# Altium schematic sheet MAX5875_0.SchDoc
size A; DocumentNumber: 3; SheetNumber: 13; SheetTotal: 24
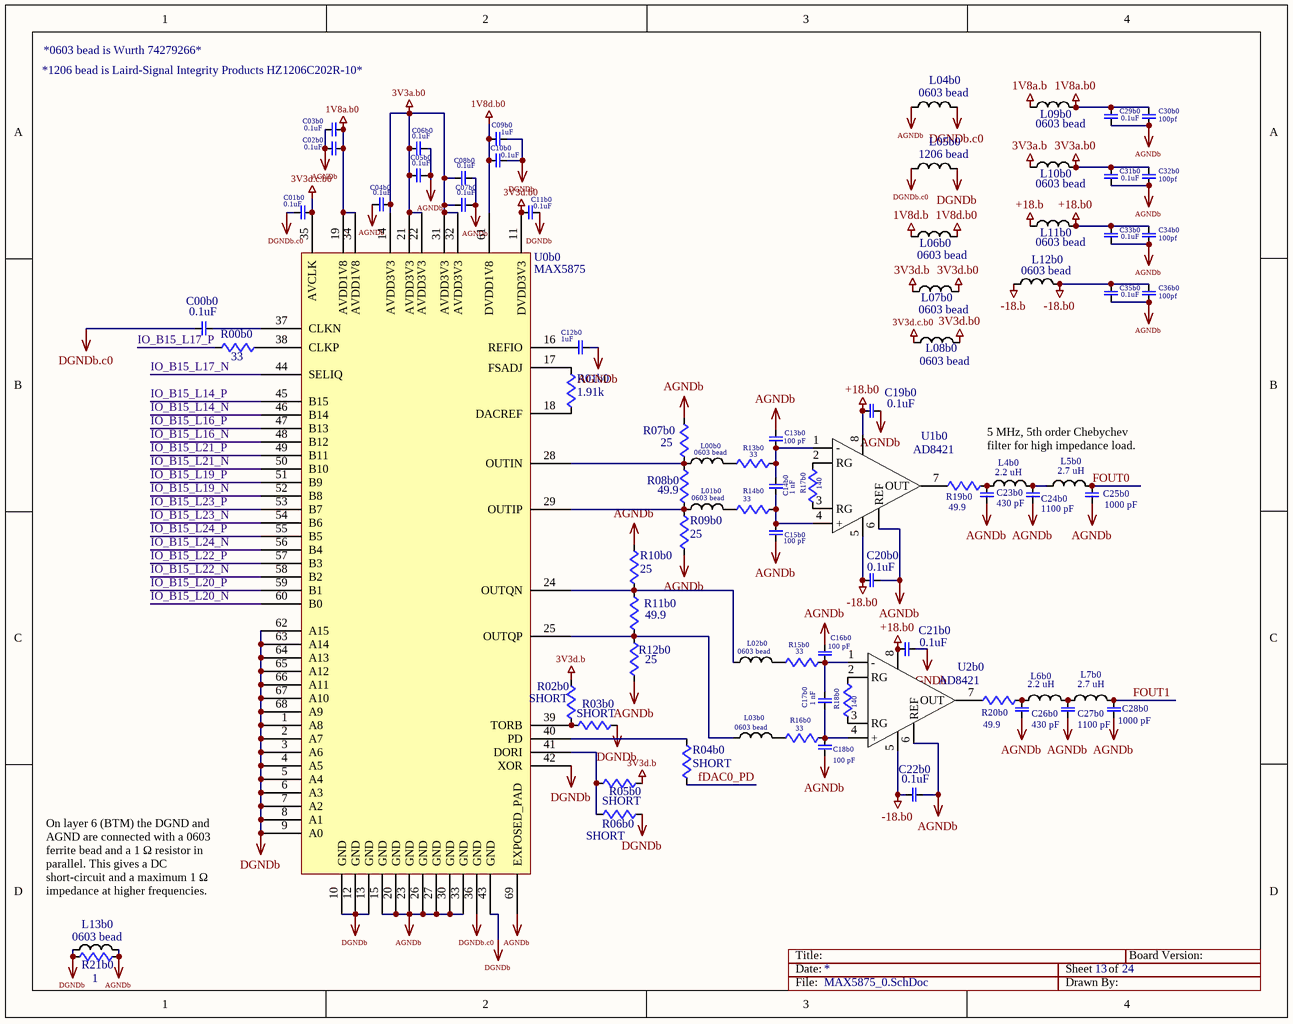
[diagram p0: MAX5875_0.SchDoc]

## Parts
C00b0  0.1uF  [0402]
C01b0  0.1uF  [0402]
C02b0  0.1uF  [0402]
C03b0  0.1uF  [0402]
C04b0  0.1uF  [0402]
C05b0  0.1uF  [0402]
C06b0  0.1uF  [0402]
C07b0  0.1uF  [0402]
C08b0  0.1uF  [0402]
C09b0  1uF  [0603]
C10b0  0.1uF  [0402]
C11b0  0.1uF  [0402]
C12b0  1uF  [0402]
C13b0  100 pF  [0603]
C14b0  1 nF  [0603]
C15b0  100 pF  [0603]
C16b0  100 pF  [0603]
C17b0  1 nF  [0603]
C18b0  100 pF  [0603]
C19b0  0.1uF  [0603]
C20b0  0.1uF  [0603]
C21b0  0.1uF  [0603]
C22b0  0.1uF  [0603]
C23b0  430 pF  [0603]
C24b0  1100 pF  [0603]
C25b0  1000 pF  [0603]
C26b0  430 pF  [0603]
C27b0  1100 pF  [0603]
C28b0  1000 pF  [0603]
C29b0  0.1uF  [0603]
C30b0  100pf  [0603]
C31b0  0.1uF  [0603]
C32b0  100pf  [0603]
C33b0  0.1uF  [0603]
C34b0  100pf  [0603]
C35b0  0.1uF  [0603]
C36b0  100pf  [0603]
L00b0  0603 bead  [0603]
L01b0  0603 bead  [0603]
L02b0  0603 bead  [0603]
L03b0  0603 bead  [0603]
L04b0  0603 bead  [0603]
L4b0  2.2 uH  [0603]
L5b0  2.7 uH  [0603]
L05b0  1206 bead  [1206]
L06b0  0603 bead  [0603]
L6b0  2.2 uH  [0603]
L7b0  2.7 uH  [0603]
L07b0  0603 bead  [0603]
L08b0  0603 bead  [0603]
L09b0  0603 bead  [0603]
L10b0  0603 bead  [0603]
L11b0  0603 bead  [0603]
L12b0  0603 bead  [0603]
L13b0  0603 bead  [0603]
R00b0  33  [0402]
R01b0  1.91k  [0603]
R02b0  SHORT  [0603]
R03b0  SHORT  [0603]
R04b0  SHORT  [0603]
R05b0  SHORT  [0603]
R06b0  SHORT  [0603]
R07b0  25  [0603]
R08b0  49.9  [0603]
R09b0  25  [0603]
R10b0  25  [0603]
R11b0  49.9  [0603]
R12b0  25  [0603]
R13b0  33  [0603]
R14b0  33  [0603]
R15b0  33  [0603]
R16b0  33  [0603]
R17b0  140  [0402]
R18b0  140  [0402]
R19b0  49.9  [0603]
R20b0  49.9  [0603]
R21b0  1  [0603]
U0b0  MAX5875  [68LQFN]
U1b0  AD8421  [8SOIC]
U2b0  AD8421  [8SOIC]

## Nets
1V8a.b: L09b0.1
1V8a.b0: C02b0.1 C03b0.2 C29b0.1 C30b0.1 L09b0.2 U0b0.19(AVDD1V8) U0b0.34(AVDD1V8)
1V8d.b: L06b0.1
1V8d.b0: C09b0.2 C10b0.2 L06b0.2 U0b0.61(DVDD1V8)
3V3a.b: L10b0.1
3V3a.b0: C04b0.1 C05b0.2 C06b0.1 C07b0.2 C08b0.1 C31b0.1 C32b0.1 L10b0.2 U0b0.14(AVDD3V3) U0b0.21(AVDD3V3) U0b0.22(AVDD3V3) U0b0.31(AVDD3V3) U0b0.32(AVDD3V3)
3V3d.b: L07b0.1 R02b0.2 R05b0.2
3V3d.b0: C11b0.2 L07b0.2 L08b0.2 U0b0.11(DVDD3V3)
3V3d.c.b0: C01b0.1 L08b0.1 U0b0.35(AVCLK)
+18.b: L11b0.1
+18.b0: C19b0.2 C21b0.2 C33b0.1 C34b0.1 L11b0.2 U1b0.8(+VS) U2b0.8(+VS)
-18.b: L12b0.1
-18.b0: C20b0.2 C22b0.2 C35b0.1 C36b0.1 L12b0.2 U1b0.5(-VS) U2b0.5(-VS)
AGNDb: C02b0.2 C03b0.1 C04b0.2 C05b0.1 C06b0.2 C07b0.1 C08b0.2 C12b0.1 C13b0.1 C15b0.1 C16b0.1 C18b0.1 C19b0.1 C20b0.1 C21b0.1 C22b0.1 C23b0.2 C24b0.2 C25b0.2 C26b0.2 C27b0.2 C28b0.2 C29b0.2 C30b0.2 C31b0.2 C32b0.2 C33b0.2 C34b0.2 C35b0.2 C36b0.2 L04b0.1 L13b0.2 R07b0.2 R09b0.1 R10b0.2 R12b0.1 R21b0.1 U0b0.15(GND) U0b0.20(GND) U0b0.23(GND) U0b0.26(GND) U0b0.27(GND) U0b0.30(GND) U0b0.33(GND) U0b0.69(EXPOSED_PAD) U1b0.6(REF) U2b0.6(REF)
DGNDb: C09b0.1 C10b0.1 C11b0.1 L05b0.2 L13b0.1 R03b0.2 R06b0.2 R21b0.2 U0b0.1(A8) U0b0.2(A7) U0b0.3(A6) U0b0.4(A5) U0b0.5(A4) U0b0.6(A3) U0b0.7(A2) U0b0.8(A1) U0b0.9(A0) U0b0.10(GND) U0b0.12(GND) U0b0.13(GND) U0b0.42(XOR) U0b0.43(GND) U0b0.62(A15) U0b0.63(A14) U0b0.64(A13) U0b0.65(A12) U0b0.66(A11) U0b0.67(A10) U0b0.68(A9)
DGNDb.c0: C00b0.2 C01b0.2 L04b0.2 L05b0.1 U0b0.36(GND)
fDAC0_PD: R04b0.2
FOUT0: C25b0.1 L5b0.2
FOUT1: C28b0.1 L7b0.2
IO_B15_L14_N: U0b0.46(B14)
IO_B15_L14_P: U0b0.45(B15)
IO_B15_L16_N: U0b0.48(B12)
IO_B15_L16_P: U0b0.47(B13)
IO_B15_L17_N: U0b0.44(SELIQ)
IO_B15_L17_P: R00b0.2
IO_B15_L19_N: U0b0.52(B8)
IO_B15_L19_P: U0b0.51(B9)
IO_B15_L20_N: U0b0.60(B0)
IO_B15_L20_P: U0b0.59(B1)
IO_B15_L21_N: U0b0.50(B10)
IO_B15_L21_P: U0b0.49(B11)
IO_B15_L22_N: U0b0.58(B2)
IO_B15_L22_P: U0b0.57(B3)
IO_B15_L23_N: U0b0.54(B6)
IO_B15_L23_P: U0b0.53(B7)
IO_B15_L24_N: U0b0.56(B4)
IO_B15_L24_P: U0b0.55(B5)
NetC00b0_1: C00b0.1 U0b0.37(CLKN)
NetC12b0_2: C12b0.2 U0b0.16(REFIO)
NetC13b0_2: C13b0.2 C14b0.1 R13b0.1 U1b0.1(-)
NetC14b0_2: C14b0.2 C15b0.2 R14b0.1 U1b0.4(+)
NetC16b0_2: C16b0.2 C17b0.1 R15b0.1 U2b0.1(-)
NetC17b0_2: C17b0.2 C18b0.2 R16b0.1 U2b0.4(+)
NetC23b0_1: C23b0.1 L4b0.1 R19b0.2
NetC24b0_1: C24b0.1 L4b0.2 L5b0.1
NetC26b0_1: C26b0.1 L6b0.1 R20b0.2
NetC27b0_1: C27b0.1 L6b0.2 L7b0.1
NetL00b0_1: L00b0.1 R07b0.1 R08b0.2 U0b0.28(OUTIN)
NetL00b0_2: L00b0.2 R13b0.2
NetL01b0_1: L01b0.1 R08b0.1 R09b0.2 U0b0.29(OUTIP)
NetL01b0_2: L01b0.2 R14b0.2
NetL02b0_1: L02b0.1 R10b0.1 R11b0.2 U0b0.24(OUTQN)
NetL02b0_2: L02b0.2 R15b0.2
NetL03b0_1: L03b0.1 R11b0.1 R12b0.2 U0b0.25(OUTQP)
NetL03b0_2: L03b0.2 R16b0.2
NetR00b0_1: R00b0.1 U0b0.38(CLKP)
NetR01b0_1: R01b0.1 U0b0.18(DACREF)
NetR01b0_2: R01b0.2 U0b0.17(FSADJ)
NetR02b0_1: R02b0.1 R03b0.1 U0b0.39(TORB)
NetR04b0_1: R04b0.1 U0b0.40(PD)
NetR05b0_1: R05b0.1 R06b0.1 U0b0.41(DORI)
NetR17b0_1: R17b0.1 U1b0.3(RG)
NetR17b0_2: R17b0.2 U1b0.2(RG)
NetR18b0_1: R18b0.1 U2b0.3(RG)
NetR18b0_2: R18b0.2 U2b0.2(RG)
NetR19b0_1: R19b0.1 U1b0.7(OUT)
NetR20b0_1: R20b0.1 U2b0.7(OUT)

## Notes on the sheet
- *1206 bead is Laird-Signal Integrity Products HZ1206C202R-10*
- *0603 bead is Wurth 74279266*
- 5 MHz, 5th order Chebychev filter for high impedance load.
- On layer 6 (BTM) the DGND and AGND are connected with a 0603 ferrite bead and a 1 Ω resistor in parallel. This gives a DC short-circuit and a maximum 1 Ω impedance at higher frequencies.
- Title:
- Date:
- Sheet
- of
- Board Version:
- File:
- Drawn By:

## Library data of the parts
C00b0 C01b0 C02b0 C03b0 C04b0 C05b0 C06b0 C07b0 C08b0 C09b0 C10b0 C11b0 C12b0 C13b0 C14b0 C15b0 C16b0 C17b0 C18b0 C19b0 C20b0 C21b0 C22b0 C23b0 C24b0 C25b0 C26b0 C27b0 C28b0 C29b0 C30b0 C31b0 C32b0 C33b0 C34b0 C35b0 C36b0 = CAP
L00b0 L01b0 L02b0 L03b0 L04b0 L4b0 L5b0 L05b0 L06b0 L6b0 L7b0 L07b0 L08b0 L09b0 L10b0 L11b0 L12b0 L13b0 = INDUCTOR
R00b0 R01b0 R02b0 R03b0 R04b0 R05b0 R06b0 R07b0 R08b0 R09b0 R10b0 R11b0 R12b0 R13b0 R14b0 R15b0 R16b0 R17b0 R18b0 R19b0 R20b0 R21b0 = RES